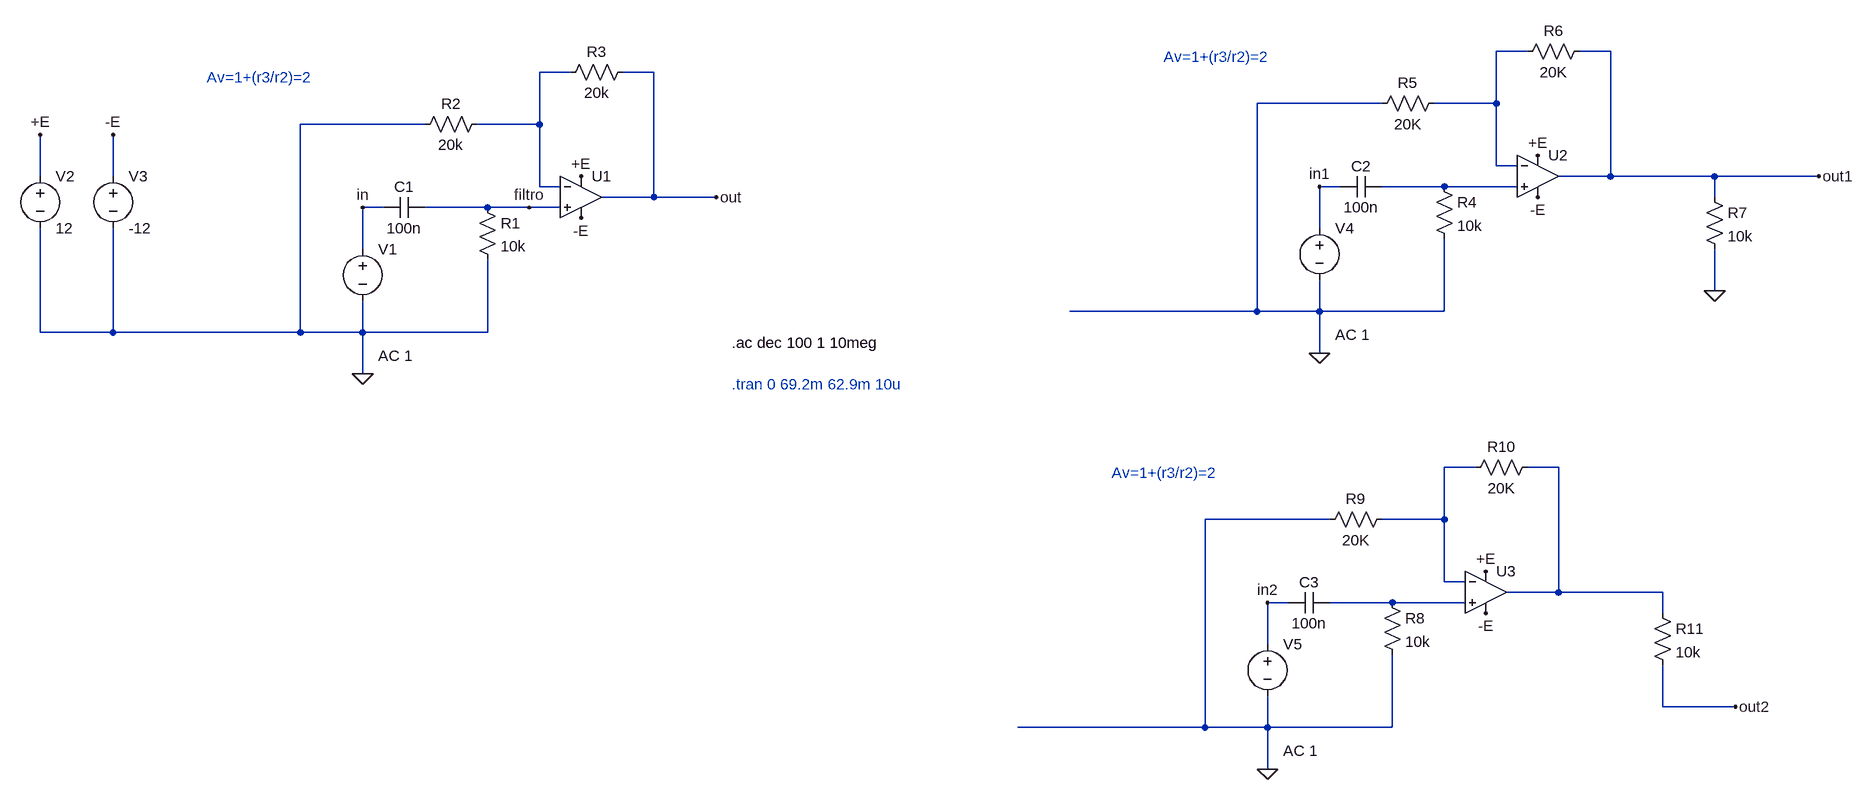
[diagram p0: schematic filto-passa-alto-rc-attivo.asc]
filto-passa-alto-rc-attivo.asc, the LTspice schematic file:
Version 4.1
SHEET 1 2216 1028
WIRE 1696 -96 1648 -96
WIRE 1824 -96 1776 -96
WIRE 224 -64 176 -64
WIRE 352 -64 304 -64
WIRE 1472 -16 1280 -16
WIRE 1648 -16 1648 -96
WIRE 1648 -16 1552 -16
WIRE 0 16 -192 16
WIRE 176 16 176 -64
WIRE 176 16 80 16
WIRE 1648 80 1648 -16
WIRE 1680 80 1648 80
WIRE -592 96 -592 32
WIRE -480 96 -480 32
WIRE 1824 96 1824 -96
WIRE 1824 96 1744 96
WIRE 1984 96 1824 96
WIRE 2144 96 1984 96
WIRE 176 112 176 16
WIRE 208 112 176 112
WIRE 1408 112 1376 112
WIRE 1568 112 1472 112
WIRE 1680 112 1568 112
WIRE 352 128 352 -64
WIRE 352 128 272 128
WIRE 448 128 352 128
WIRE 1984 128 1984 96
WIRE -64 144 -96 144
WIRE 96 144 0 144
WIRE 160 144 96 144
WIRE 208 144 160 144
WIRE 1376 176 1376 112
WIRE -96 208 -96 144
WIRE 1984 272 1984 208
WIRE 1280 304 1280 -16
WIRE 1280 304 992 304
WIRE 1376 304 1376 256
WIRE 1376 304 1280 304
WIRE 1568 304 1568 192
WIRE 1568 304 1376 304
WIRE -592 336 -592 176
WIRE -480 336 -480 176
WIRE -480 336 -592 336
WIRE -192 336 -192 16
WIRE -192 336 -480 336
WIRE -96 336 -96 288
WIRE -96 336 -192 336
WIRE 96 336 96 224
WIRE 96 336 -96 336
WIRE 1376 368 1376 304
WIRE -96 400 -96 336
WIRE 1616 544 1568 544
WIRE 1744 544 1696 544
WIRE 1392 624 1200 624
WIRE 1568 624 1568 544
WIRE 1568 624 1472 624
WIRE 1568 720 1568 624
WIRE 1600 720 1568 720
WIRE 1744 736 1744 544
WIRE 1744 736 1664 736
WIRE 1904 736 1744 736
WIRE 1328 752 1296 752
WIRE 1488 752 1392 752
WIRE 1600 752 1488 752
WIRE 1904 768 1904 736
WIRE 1296 816 1296 752
WIRE 1904 912 1904 848
WIRE 2016 912 1904 912
WIRE 1200 944 1200 624
WIRE 1200 944 912 944
WIRE 1296 944 1296 896
WIRE 1296 944 1200 944
WIRE 1488 944 1488 832
WIRE 1488 944 1296 944
WIRE 1296 1008 1296 944
FLAG -96 400 0
FLAG 448 128 out
FLAG -96 144 in
FLAG -592 32 +E
FLAG -480 32 -E
FLAG 240 160 -E
FLAG 240 96 +E
FLAG 1376 368 0
FLAG 1376 112 in1
FLAG 1712 128 -E
FLAG 1712 64 +E
FLAG 1984 272 0
FLAG 2144 96 out1
FLAG 1296 1008 0
FLAG 1296 752 in2
FLAG 1632 768 -E
FLAG 1632 704 +E
FLAG 2016 912 out2
FLAG 160 144 filtro
SYMBOL cap 0 128 R90
WINDOW 0 0 32 VBottom 2
WINDOW 3 32 32 VTop 2
SYMATTR InstName C1
SYMATTR Value 100n
SYMBOL res 80 128 R0
SYMATTR InstName R1
SYMATTR Value 10k
SYMBOL OpAmps\\UniversalOpAmp2 240 128 R0
SYMATTR InstName U1
SYMATTR Value2 Avol=1e12 GBW=1e15 Slew=1e15
SYMATTR SpiceLine Ilimit=1e9 Rail=0 Vos=0
SYMATTR SpiceLine2 En=0 Enk=0 In=0 Ink=0 Rin=1e12
SYMBOL res 96 0 R90
WINDOW 0 0 56 VBottom 2
WINDOW 3 32 56 VTop 2
SYMATTR InstName R2
SYMATTR Value 20k
SYMBOL res 320 -80 R90
WINDOW 0 0 56 VBottom 2
WINDOW 3 32 56 VTop 2
SYMATTR InstName R3
SYMATTR Value 20k
SYMBOL voltage -96 192 R0
WINDOW 3 24 152 Left 2
WINDOW 123 24 180 Left 2
WINDOW 39 0 0 Left 0
SYMATTR Value ""
SYMATTR Value2 AC 1
SYMATTR InstName V1
SYMBOL voltage -592 80 R0
WINDOW 123 0 0 Left 0
WINDOW 39 0 0 Left 0
SYMATTR InstName V2
SYMATTR Value 12
SYMBOL voltage -480 80 R0
WINDOW 123 0 0 Left 0
WINDOW 39 0 0 Left 0
SYMATTR InstName V3
SYMATTR Value -12
SYMBOL cap 1472 96 R90
WINDOW 0 0 32 VBottom 2
WINDOW 3 32 32 VTop 2
SYMATTR InstName C2
SYMATTR Value 100n
SYMBOL res 1552 96 R0
SYMATTR InstName R4
SYMATTR Value 10k
SYMBOL OpAmps\\UniversalOpAmp2 1712 96 R0
SYMATTR InstName U2
SYMBOL res 1568 -32 R90
WINDOW 0 0 56 VBottom 2
WINDOW 3 32 56 VTop 2
SYMATTR InstName R5
SYMATTR Value 20K
SYMBOL res 1792 -112 R90
WINDOW 0 0 56 VBottom 2
WINDOW 3 32 56 VTop 2
SYMATTR InstName R6
SYMATTR Value 20K
SYMBOL voltage 1376 160 R0
WINDOW 3 24 152 Left 2
WINDOW 123 24 180 Left 2
WINDOW 39 0 0 Left 0
SYMATTR Value ""
SYMATTR Value2 AC 1
SYMATTR InstName V4
SYMBOL res 1968 112 R0
SYMATTR InstName R7
SYMATTR Value 10k
SYMBOL cap 1392 736 R90
WINDOW 0 0 32 VBottom 2
WINDOW 3 32 32 VTop 2
SYMATTR InstName C3
SYMATTR Value 100n
SYMBOL res 1472 736 R0
SYMATTR InstName R8
SYMATTR Value 10k
SYMBOL OpAmps\\UniversalOpAmp2 1632 736 R0
SYMATTR InstName U3
SYMBOL res 1488 608 R90
WINDOW 0 0 56 VBottom 2
WINDOW 3 32 56 VTop 2
SYMATTR InstName R9
SYMATTR Value 20K
SYMBOL res 1712 528 R90
WINDOW 0 0 56 VBottom 2
WINDOW 3 32 56 VTop 2
SYMATTR InstName R10
SYMATTR Value 20K
SYMBOL voltage 1296 800 R0
WINDOW 3 24 152 Left 2
WINDOW 123 24 180 Left 2
WINDOW 39 0 0 Left 0
SYMATTR Value ""
SYMATTR Value2 AC 1
SYMATTR InstName V5
SYMBOL res 1888 752 R0
SYMATTR InstName R11
SYMATTR Value 10k
TEXT 472 352 Left 2 !.ac dec 100 1 10meg
TEXT 472 416 Left 2 ;.tran 0 69.2m 62.9m 10u
TEXT -336 -56 Left 2 ;Av=1+(r3/r2)=2
TEXT 1136 -88 Left 2 ;Av=1+(r3/r2)=2
TEXT 1056 552 Left 2 ;Av=1+(r3/r2)=2

The netlist it stands for:
* filto-passa-alto-rc-attivo.asc
C1 filtro in 100n
R1 filtro 0 10k
X§U1 filtro N002 +E -E out level2 Avol=1e12 GBW=1e15 Slew=1e15 Ilimit=1e9 Rail=0 Vos=0 En=0 Enk=0 In=0 Ink=0 Rin=1e12  ; pins In+ In- V+ V- OUT
R2 N002 0 20k
R3 out N002 20k
V1 in 0 AC 1
V2 +E 0 12
V3 -E 0 -12
C2 N003 in1 100n
R4 N003 0 10k
X§U2 N003 N001 +E -E out1 level2 Avol=1Meg GBW=10Meg Slew=10Meg Ilimit=25m Rail=0 Vos=0 En=0 Enk=0 In=0 Ink=0 Rin=500Meg  ; pins In+ In- V+ V- OUT
R5 N001 0 20K
R6 out1 N001 20K
V4 in1 0 AC 1
R7 out1 0 10k
C3 N006 in2 100n
R8 N006 0 10k
X§U3 N006 N004 +E -E N005 level2 Avol=1Meg GBW=10Meg Slew=10Meg Ilimit=25m Rail=0 Vos=0 En=0 Enk=0 In=0 Ink=0 Rin=500Meg  ; pins In+ In- V+ V- OUT
R9 N004 0 20K
R10 N005 N004 20K
V5 in2 0 AC 1
R11 N005 out2 10k
.ac dec 100 1 10meg
* .tran 0 69.2m 62.9m 10u
* Av=1+(r3/r2)=2
* Av=1+(r3/r2)=2
* Av=1+(r3/r2)=2
.lib UniversalOpAmp2.lib
.backanno
.end